# EAGLE design mps-v1 (EAGLE 7.3.0)
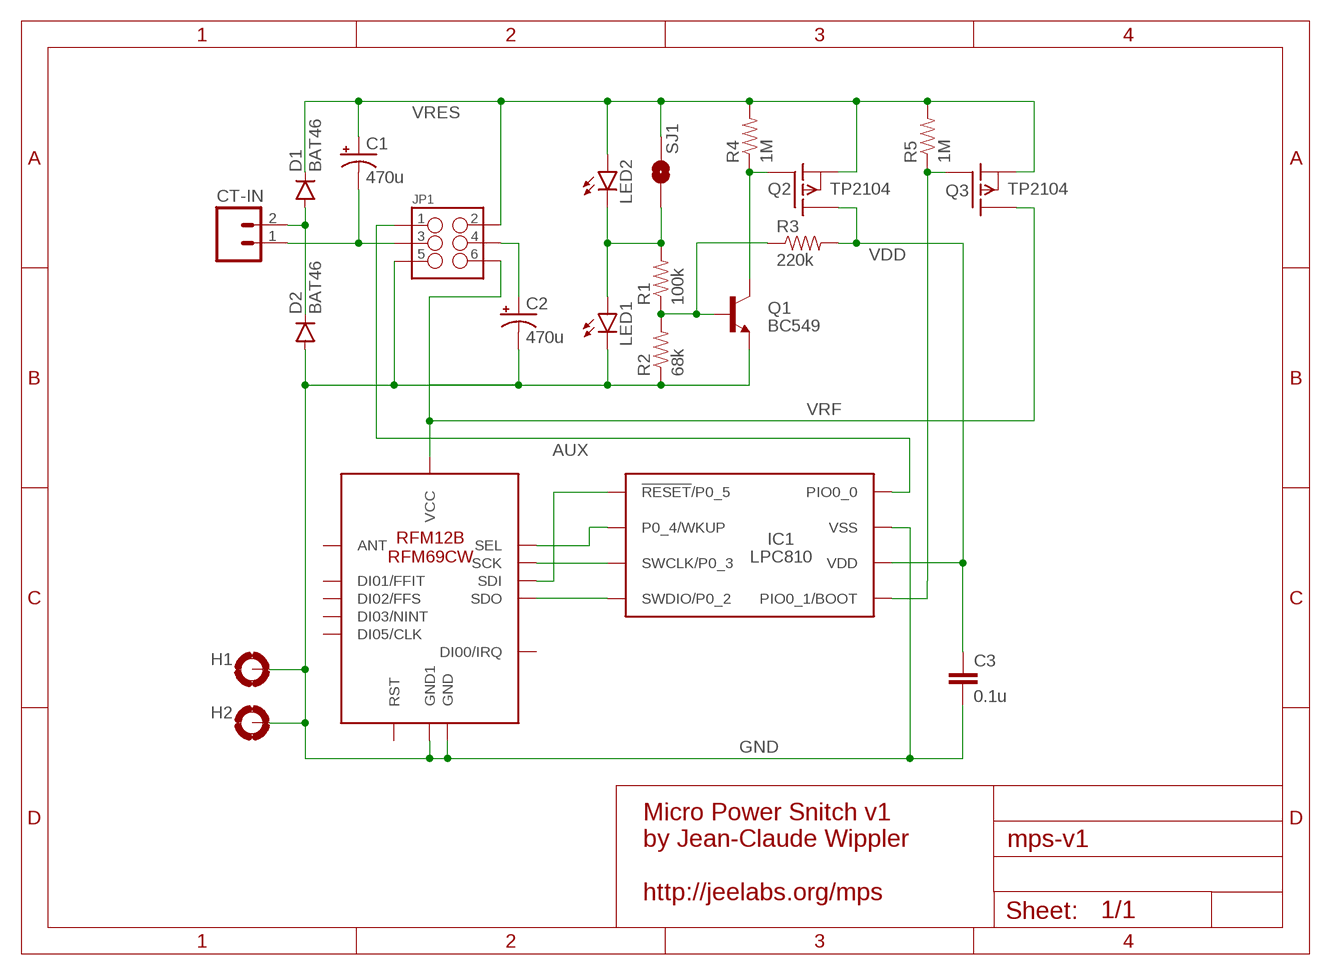
[diagram p0: schematic, sheet 1]

## Parts
C1  470u  CAP_POLPTH1  [CPOL-RADIAL-100UF-25V]
C2  470u  CAP_POLPTH1  [CPOL-RADIAL-100UF-25V]
C3  0.1u  CAPPTH  [CAP-PTH-SMALL]
CT-IN  M023.5MM  [SCREWTERMINAL-3.5MM-2]
D1  BAT46  DIODE1N4148  [DIODE-1N4148]
D2  BAT46  DIODE1N4148  [DIODE-1N4148]
H1  MOUNT-PAD-ROUND2.8  [2,8-PAD]
H2  MOUNT-PAD-ROUND2.8  [2,8-PAD]
IC1  LPC810  LPC810M021FN8  [DIP8]
JP1  M03X2NO_SILK  [2X3-NS]
LED1  LED3MM  [LED3MM]
LED2  LED3MM  [LED3MM]
Q1  BC549  BC547  [TO92]
Q2  TP2104  BSS110  [TO92]
Q3  TP2104  BSS110  [TO92]
R1  100k  RESISTORAXIAL-0.3  [AXIAL-0.3]
R2  68k  RESISTORAXIAL-0.3  [AXIAL-0.3]
R3  220k  RESISTORAXIAL-0.3  [AXIAL-0.3]
R4  1M  RESISTORAXIAL-0.3  [AXIAL-0.3]
R5  1M  RESISTORAXIAL-0.3  [AXIAL-0.3]
RFM12B/69CW  RFM12B/69CW  [RFM12B/69CW]
SJ1  JUMPER-PAD-2-NO  [PAD-JUMPER-2-NO_NO_SILK]

## Nets
AUX: IC1.P$8(PIO0_0) JP1.1
GND [power]: C2.2(-) C3.2 D2.A H1.B2,8(MOUNT) H2.B2,8(MOUNT) IC1.P$7(VSS) JP1.5 LED1.K(C) Q1.1(E) R2.P$1 RFM12B/69CW.GND RFM12B/69CW.GND1
N$1 [power]: CT-IN.2 D1.A D2.C
N$2: C2.1(+) JP1.4
N$4: IC1.P$3(SWCLK/P0_3) RFM12B/69CW.SCK
N$5: C1.2(-) CT-IN.1 JP1.3
N$7: LED1.A LED2.K(C) R1.P$2 SJ1.1
N$8: Q1.3(C) Q2.2(G) R4.P$1
N$9: Q1.2(B) R1.P$1 R2.P$2 R3.P$1
N$11: IC1.P$1(!RESET!/P0_5) RFM12B/69CW.SDI
N$12: IC1.P$2(P0_4/WKUP) RFM12B/69CW.SEL
N$14: IC1.P$4(SWDIO/P0_2) RFM12B/69CW.SDO
N$15: IC1.P$5(PIO0_1/BOOT) Q3.2(G) R5.P$1
VDD [power]: C3.1 IC1.P$6(VDD) Q2.3(D) R3.P$2
VRES [power]: C1.1(+) D1.C JP1.2 LED2.A Q2.1(S) Q3.1(S) R4.P$2 R5.P$2 SJ1.2
VRF [power]: JP1.6 Q3.3(D) RFM12B/69CW.VDD(VCC)
Unconnected: RFM12B/69CW.ANT RFM12B/69CW.CLK(DI05/CLK) RFM12B/69CW.FFIT(DI01/FFIT) RFM12B/69CW.FFS(DI02/FFS) RFM12B/69CW.IRQ(DI00/IRQ) RFM12B/69CW.NINT(DI03/NINT) RFM12B/69CW.RST

## Notes on the sheet
- Micro Power Snitch v1
  by Jean-Claude Wippler
  
  http://jeelabs.org/mps

## Library data of the parts
C1 C2 = SparkFun-Capacitors:CAP_POL: Capacitor Polarized These are standard SMD and PTH capacitors. Normally 10uF, 47uF, and 100uF in electrolytic and tantalum varieties. Always verify the external diameter of the through hole cap, it varies with capacity, voltage, and manufacturer. The EIA devices should be standard.
C3 = SparkFun-Capacitors:CAP: Capacitor Standard 0603 ceramic capacitor, and 0.1" leaded capacitor.
CT-IN = SparkFun-Connectors:M02: Standard 2-pin 0.1" header. Use with - straight break away headers ( PRT-00116) - right angle break away headers (PRT-00553) - swiss pins (PRT-00743) - machine pins (PRT-00117) - female headers (PRT-00115) Molex polarized connector foot print use with: PRT-08233 with associated crimp pins and housings. 2.54_SCREWTERM for use with PRT-10571. 3.5mm Screw Terminal footprints for PRT-08084 5mm Screw Terminal footprints for use with PRT-08432
D1 D2 = SparkFun-DiscreteSemi:DIODE: Diode These are standard reverse protection diodes and small signal diodes. SMA package can handle up to about 1A. SOD-323 can handle about 200mA. What the SOD-323 package when ordering, there are some mfgs out there that are 5-pin packages.
H1 H2 = holes:MOUNT-PAD-ROUND: MOUNTING PAD, round
IC1 = carrilib:LPC810
JP1 = SparkFun-Connectors:M03X2: 2x3 .1" header. Shrouded, with keying- CONN-10681 SMT- CONN-11415 Pogo pins- HW-11044
LED1 LED2 = SparkFun-LED:LED: LEDs Standard schematic elements and footprints for 5mm, 3mm, 1206, and 0603 sized LEDs. 5mm - Spark Fun Electronics SKU : COM-00529 (and others)
Q1 = transistor:BC547: NPN TRANSISTOR
Q2 Q3 = transistor-fet:BSS110: P-Channel Enhancement MOSFET -50V; -0,17A; 6Ohm
R1-R5 = SparkFun-Passives:RESISTOR: Resistor Basic schematic elements and footprints for 0603, 1206, and PTH resistors.
RFM12B/69CW = Eagle-JeeLabs:RFM12B/69CW
SJ1 = SparkFun-Passives:JUMPER-PAD-2-NO

## Net classes
0 default: width 0.254 mm
1 power: width 0.254 mm

## Board
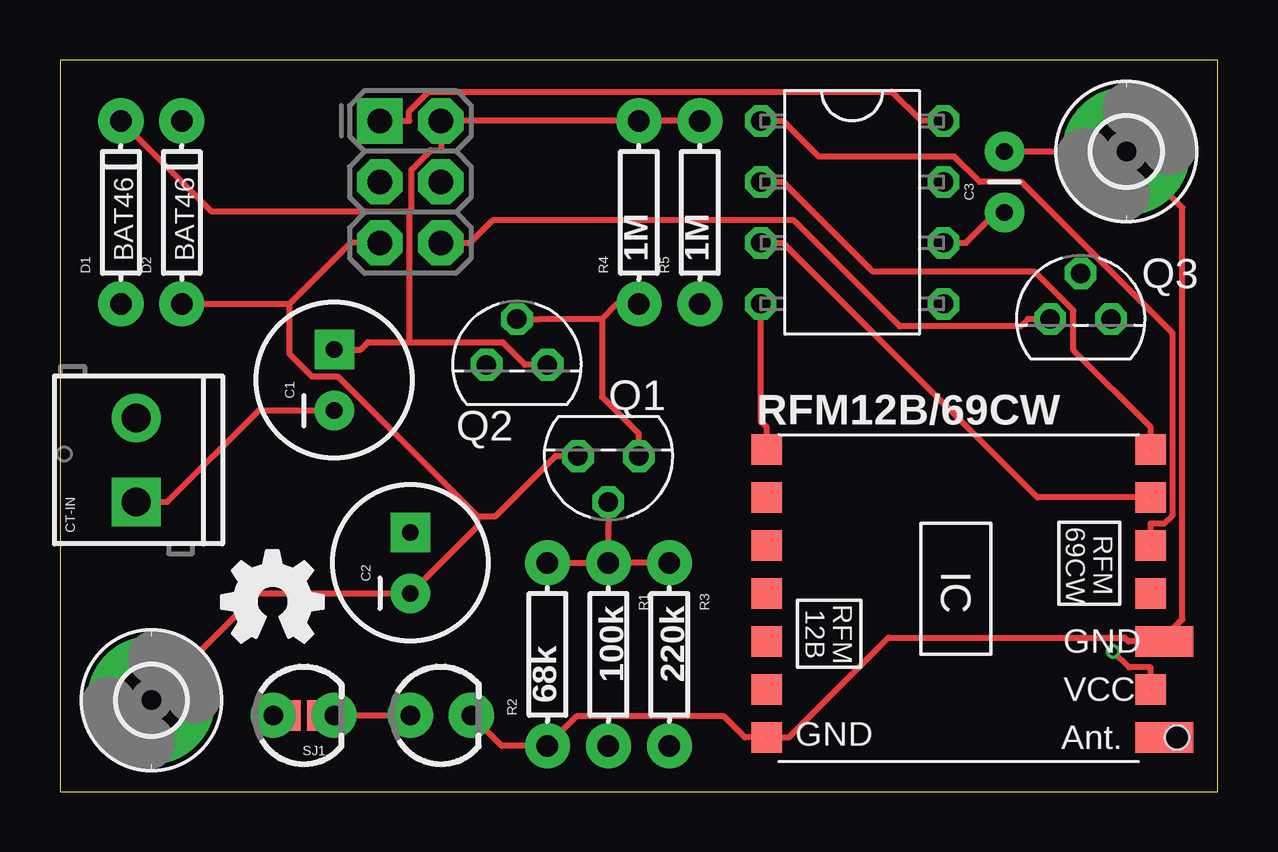
[diagram p1: board, top side]
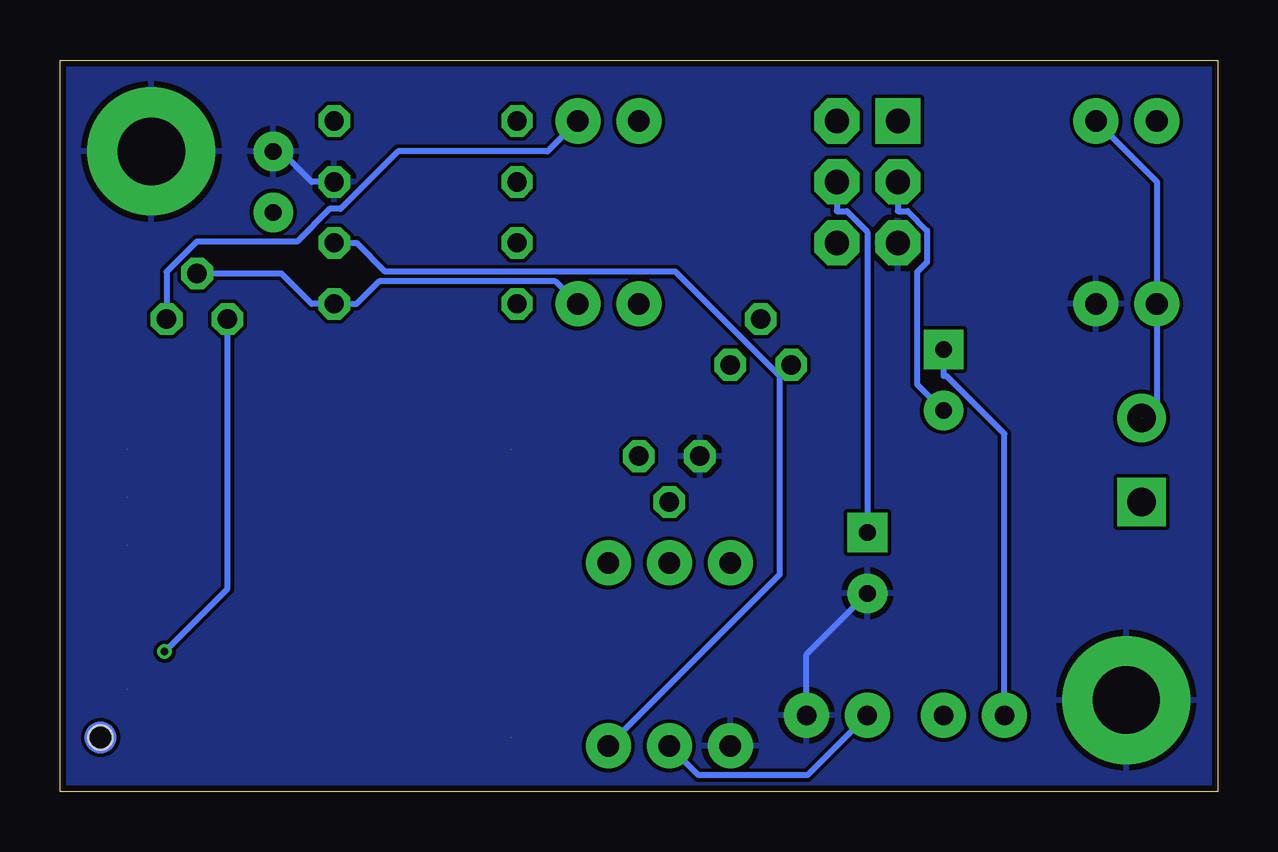
[diagram p2: board, bottom side, seen from below]

Size 48.26 x 30.48 mm. Coordinates in mm from the lower left corner, seen from the top.
Outline: 0,0 48.26,0 48.26,30.48 0,30.48 0,0
Copper layers (1*16): Top 0.035mm / dielectric 1.5mm / Bottom 0.035mm
Design rules "ITEADstudio_DRC": minimum track width 6mil, minimum drill 12mil, track to track 6mil, track to pad 6mil, pad to pad 6mil, via to via 6mil, smd to smd 0mil, copper to edge 10mil, drill to drill 10mil, minimum pad ring 10mil, minimum via ring 6mil, stop-mask expansion 2mil, vias tented up to drill 100mil, thermal gap 10mil

### Footprints (pad centres in the part's own frame; a part is rotated, then mirrored left to right if it is on the bottom)
CPOL-RADIAL-100UF-25V = drill 0.7 pad 1.651 square: 1 1.27,0 | drill 0.7 pad 1.651: 2 -1.27,0
CAP-PTH-SMALL = drill 0.7 pad 1.651: 1 0,0; 2 2.54,0
SCREWTERMINAL-3.5MM-2 = drill 1.2 pad 2.032 square: 1 0,0 | drill 1.2 pad 2.032: 2 3.5,0
DIODE-1N4148 = drill 0.9 pad 1.88: A -3.81,0; C 3.81,0
2,8-PAD = drill 2.8 pad 5.334: B2,8 0,0
DIP8 = drill 0.8 octagon: P$1 -3.81,3.81; P$2 -3.81,1.27; P$3 -3.81,-1.27; P$4 -3.81,-3.81; P$5 3.81,-3.81; P$6 3.81,-1.27; P$7 3.81,1.27; P$8 3.81,3.81
2X3-NS = drill 1.016 pad 1.88 square: 1 -2.54,-1.27 | drill 1.016 pad 1.88 octagon: 2 -2.54,1.27; 3 0,-1.27; 4 0,1.27; 5 2.54,-1.27; 6 2.54,1.27
LED3MM = drill 0.813 pad 1.88: A -1.27,0; K 1.27,0
TO92 = drill 0.813 octagon: 1 1.27,0; 2 0,1.905; 3 -1.27,0
AXIAL-0.3 = drill 0.9 pad 1.88: P$1 -3.81,0; P$2 3.81,0
RFM12B/69CW = smd 2.413 x 1.27: ANT 8.56,-6; GND 8.56,-2 | smd 1.27 x 1.27: CLK -8,-2; FFIT -8,0; FFS -8,2; GND1 -8,-6; IRQ -8,4; NINT 8,0; RST -8,-4; SCK 8,4; SDI 8,2; SDO -8,6; SEL 8,6; VDD 8,-4 | hole 1: 9.1,-6
PAD-JUMPER-2-NO_NO_SILK = smd 0.635 x 1.27: 1 -0.45,0; 2 0.45,0

### Placement (x,y rotation side)
C1  11.43,17.14 90 top
C2  14.61,9.53 90 top
C3  39.37,24.13 90 top
CT-IN  3.17,12.06 90 top
D1  2.54,24.13 90 top
D2  5.08,24.13 90 top
H1  44.45,26.67 0 top
H2  3.81,3.81 0 top
IC1  33.02,24.13 0 top
JP1  14.61,25.4 270 top
LED1  15.88,3.17 0 top
LED2  10.16,3.17 0 top
LOGO1  OSHW_LOGO_FILLX0150-NT  [OSHW_FILLX150_NOTEXT]  6.73,6.22 0 top
Q1  22.86,13.97 180 top
Q2  19.05,17.78 0 top
Q3  42.55,19.68 0 top
R1  22.86,5.71 270 top
R2  20.32,5.71 90 top
R3  25.4,5.71 270 top
R4  24.13,24.13 90 top
R5  26.67,24.13 90 top
RFM12B/69CW  37.47,8.26 0 top
SJ1  10.16,3.17 180 top

### Tracks (layer width: path | path; a pad name or v marks a point on that pad's centre or on a via)
AUX
  Top 0.254: IC1.P$8 35.9,27.94 34.68,29.16 15.36,29.16 14.55,28.35 14.55,27.94 JP1.1
GND  (1 unrouted)
  Top 0.254: 45.87,6.25 46.79,7.17 46.79,24.33 H1.B2,8 C3.2 | RFM12B/69CW.GND 45.87,6.25 | 45.87,6.25 45.85,6.25 44.54,6.25 44.38,6.42 34.54,6.42 30.38,2.25 RFM12B/69CW.GND1 29.01,2.25 28.55,2.25 27.68,3.13 21.54,3.13 R2.P$1 18.41,1.91 LED1.K | Q1.1 20.65,13.97 18.15,11.47 17.41,11.47 | 17.41,11.47 11.58,17.29 10.5,17.29 9.58,18.21 9.58,20.32 | 17.41,11.47 17.41,11.05 C2.2 8.26,8.26 H2.B2,8 | 9.58,20.32 12.12,22.86 JP1.5 | D2.A 9.58,20.32
  Bottom 0.254: IC1.P$7 37.76,25.4 39.03,26.67 C3.2 | LED1.K 17.14,5.71 C2.2
  pour Bottom: -1.27,31.75 49.53,31.75 49.53,-1.27 -1.27,-1.27
N$1  (1 unrouted)
  Bottom 0.254: D2.C 2.54,25.4 D1.A 2.54,16.2 CT-IN.2
N$2
  Bottom 0.254: JP1.4 15.88,24.18 15.46,24.18 14.61,23.32 C2.1
N$4  (1 unrouted)
  Top 0.254: IC1.P$3 30.14,22.86 40.75,12.26 RFM12B/69CW.SCK
N$5
  Top 0.254: CT-IN.1 4.47,12.06 8.28,15.88 C1.2
  Bottom 0.254: JP1.3 13.34,24.18 12.93,24.18 12.12,23.37 12.12,22.06 12.54,21.64 12.54,16.98 C1.2
N$7  (1 unrouted)
  Top 0.254: LED1.A LED2.K SJ1.1
  Bottom 0.254: LED1.A 17.1,0.68 21.64,0.68 R1.P$2
N$8
  Top 0.254: 22.59,19.68 22.59,16.45 24.13,14.91 Q1.3 | R4.P$1 23.23,20.32 22.59,19.68 | 22.59,19.68 19.99,19.68 Q2.2
N$9
  Top 0.254: R1.P$1 22.86,11.12 Q1.2 | R2.P$2 R1.P$1 | R3.P$1 R1.P$1
N$11  (1 unrouted)
  Top 0.254: IC1.P$1 30.14,27.94 31.63,26.45 37.28,26.45 38.34,25.4 40.06,25.4 46.38,19.09 46.38,11.5 46.05,11.17 45.47,11.17 RFM12B/69CW.SDI
N$12  (1 unrouted)
  Top 0.254: IC1.P$2 30.14,25.4 33.88,21.66 40.63,21.66 42.24,20.05 42.24,18.39 45.47,15.17 RFM12B/69CW.SEL
N$14  (1 unrouted)
  Top 0.254: RFM12B/69CW.SDO 29.46,15.17 29.21,15.42 IC1.P$4
N$15
  Bottom 0.254: R5.P$1 27.61,21.25 34.96,21.25 35.9,20.32 IC1.P$5 37.76,20.32 39.03,21.59 Q3.2
VDD
  Top 0.254: IC1.P$6 37.76,22.86 39.03,24.13 C3.1
  Bottom 0.254: 18.26,17.3 22.61,21.66 34.7,21.66 35.9,22.86 IC1.P$6 | R3.P$2 18.26,9.05 18.26,17.3 | Q2.3 18.26,17.3
VRES  (1 unrouted)
  Top 0.254: 14.56,18.72 18.44,18.72 19.38,17.78 Q2.1 | 14.56,18.72 12.84,18.72 12.54,18.41 C1.1 | 14.55,24.18 14.56,24.17 14.56,18.72 | 14.55,24.18 14.65,24.28 14.65,25.91 15.46,26.72 15.88,26.72 JP1.2 R4.P$2 R5.P$2 | D1.C 6.3,24.18 14.55,24.18 | SJ1.2 LED2.A
  Bottom 0.254: R5.P$2 27.94,26.67 34.17,26.67 36.57,24.27 37.02,24.27 38.38,22.91 42.55,22.91 43.81,21.65 Q3.1 | C1.1 11.43,17.31 11.3,17.31 8.89,14.9 LED2.A
VRF  (via drill 0.3 pad 0.61)  (1 unrouted)
  Top 0.254: RFM12B/69CW.VDD 45.47,5.17 44.56,5.17 v43.9,5.83 | JP1.6 17.09,22.86 18.03,23.79 30.59,23.79 35,19.38 40.03,19.38 40.34,19.68 Q3.3
  Bottom 0.254: v43.9,5.83 41.27,8.46 Q3.3

### Text on the board
tValues: Aux | Vin | C1 | C2 | Gnd | Vrf | JeeLabs.org/mps v1